# Altium project TP_IHM.PrjPCB
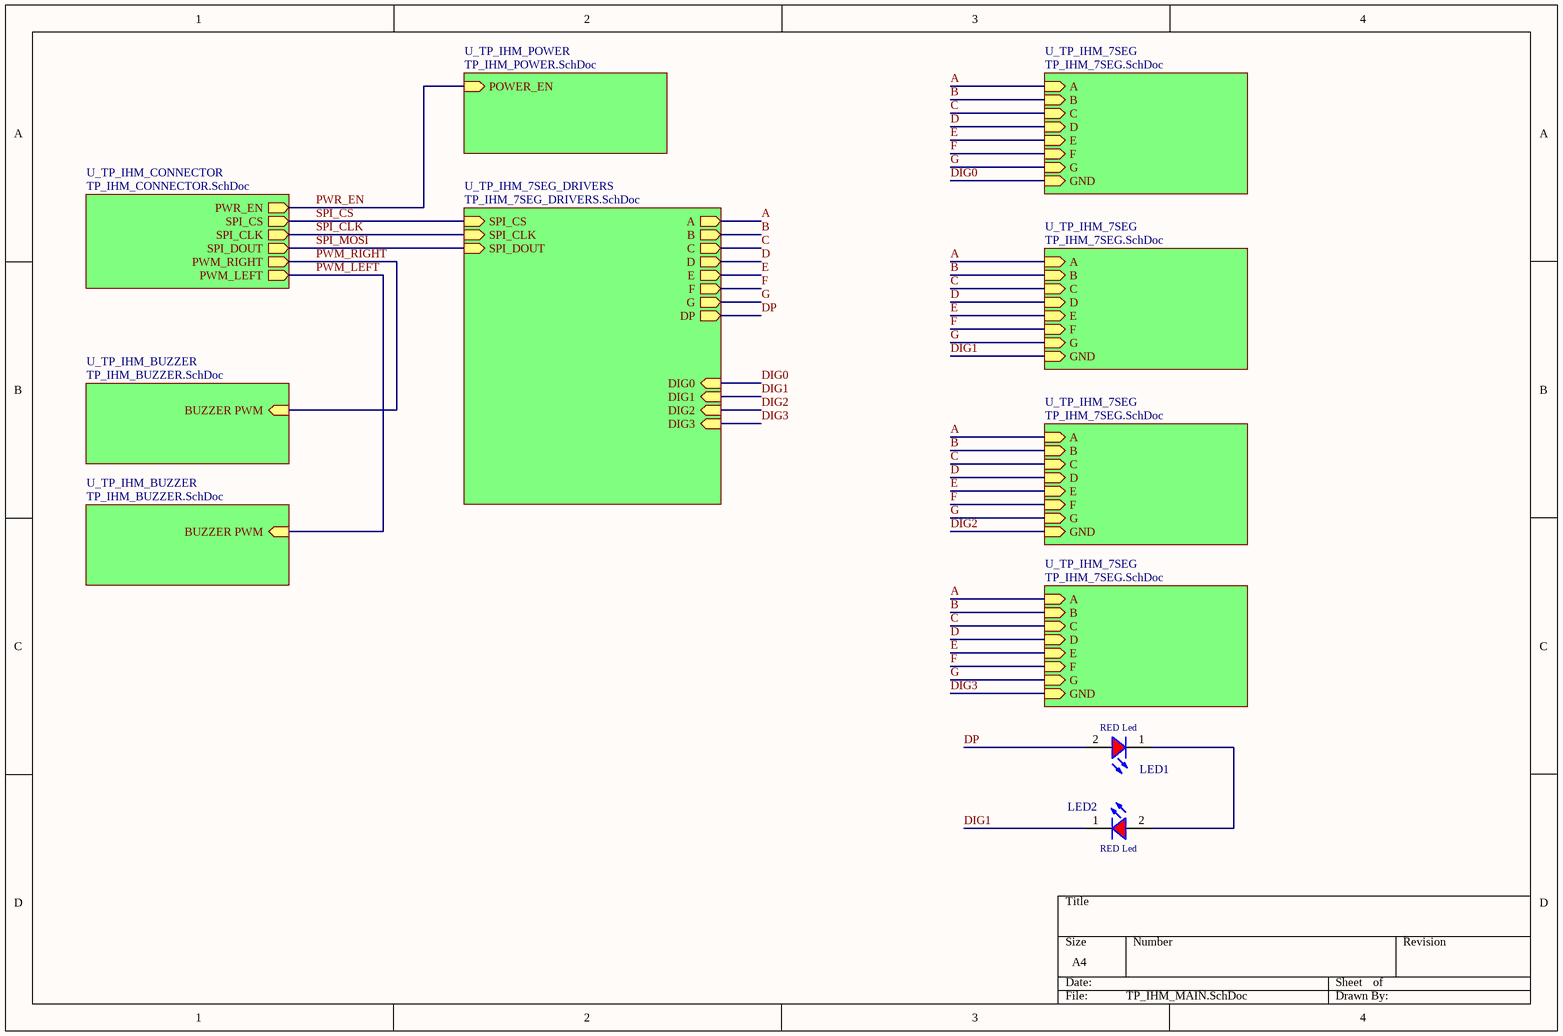
[diagram p0: TP_IHM_MAIN.SchDoc]
6 sheets, 56 parts. Net scope: hierarchical (ports join the sheet entries above them; power ports are global).
Sheets:
  TP_IHM_MAIN.SchDoc
    U_TP_IHM_BUZZER = TP_IHM_BUZZER.SchDoc
    U_TP_IHM_BUZZER = TP_IHM_BUZZER.SchDoc
    U_TP_IHM_POWER = TP_IHM_POWER.SchDoc
    U_TP_IHM_7SEG = TP_IHM_7SEG.SchDoc
    U_TP_IHM_7SEG = TP_IHM_7SEG.SchDoc
    U_TP_IHM_7SEG = TP_IHM_7SEG.SchDoc
    U_TP_IHM_7SEG = TP_IHM_7SEG.SchDoc
    U_TP_IHM_7SEG_DRIVERS = TP_IHM_7SEG_DRIVERS.SchDoc
    U_TP_IHM_CONNECTOR = TP_IHM_CONNECTOR.SchDoc

## Sheet TP_IHM_MAIN.SchDoc
size A4

### Parts
LED1  RED Led  [LED_0603_RED]
LED2  RED Led  [LED_0603_RED]

### Sub-sheets
U_TP_IHM_7SEG = TP_IHM_7SEG.SchDoc: A (in), B (in), C (in), D (in), E (in), F (in), G (in), GND (in)
U_TP_IHM_7SEG = TP_IHM_7SEG.SchDoc: A (in), B (in), C (in), D (in), E (in), F (in), G (in), GND (in)
U_TP_IHM_7SEG = TP_IHM_7SEG.SchDoc: A (in), B (in), C (in), D (in), E (in), F (in), G (in), GND (in)
U_TP_IHM_7SEG = TP_IHM_7SEG.SchDoc: A (in), B (in), C (in), D (in), E (in), F (in), G (in), GND (in)
U_TP_IHM_7SEG_DRIVERS = TP_IHM_7SEG_DRIVERS.SchDoc: DIG3 (in), DIG2 (in), DIG1 (in), DIG0 (in), DP (out), G (out), F (out), E (out), D (out), C (out), B (out), A (out), SPI_CS (in), SPI_CLK (in), SPI_DOUT (in)
U_TP_IHM_BUZZER = TP_IHM_BUZZER.SchDoc: BUZZER PWM (in)
U_TP_IHM_BUZZER = TP_IHM_BUZZER.SchDoc: BUZZER PWM (in)
U_TP_IHM_CONNECTOR = TP_IHM_CONNECTOR.SchDoc: PWM_LEFT (out), PWM_RIGHT (out), PWR_EN (out), SPI_CS (out), SPI_CLK (out), SPI_DOUT (out)
U_TP_IHM_POWER = TP_IHM_POWER.SchDoc: POWER_EN (in)

### Nets
A: sheet U_TP_IHM_7SEG/A, sheet U_TP_IHM_7SEG/A, sheet U_TP_IHM_7SEG/A, sheet U_TP_IHM_7SEG/A, sheet U_TP_IHM_7SEG_DRIVERS/A
B: sheet U_TP_IHM_7SEG/B, sheet U_TP_IHM_7SEG/B, sheet U_TP_IHM_7SEG/B, sheet U_TP_IHM_7SEG/B, sheet U_TP_IHM_7SEG_DRIVERS/B
C: sheet U_TP_IHM_7SEG/C, sheet U_TP_IHM_7SEG/C, sheet U_TP_IHM_7SEG/C, sheet U_TP_IHM_7SEG/C, sheet U_TP_IHM_7SEG_DRIVERS/C
D: sheet U_TP_IHM_7SEG/D, sheet U_TP_IHM_7SEG/D, sheet U_TP_IHM_7SEG/D, sheet U_TP_IHM_7SEG/D, sheet U_TP_IHM_7SEG_DRIVERS/D
DIG0: sheet U_TP_IHM_7SEG/GND, sheet U_TP_IHM_7SEG_DRIVERS/DIG0
DIG1: LED2.1(K) ; sheet U_TP_IHM_7SEG/GND, sheet U_TP_IHM_7SEG_DRIVERS/DIG1
DIG2: sheet U_TP_IHM_7SEG/GND, sheet U_TP_IHM_7SEG_DRIVERS/DIG2
DIG3: sheet U_TP_IHM_7SEG/GND, sheet U_TP_IHM_7SEG_DRIVERS/DIG3
DP: LED1.2(A) ; sheet U_TP_IHM_7SEG_DRIVERS/DP
E: sheet U_TP_IHM_7SEG/E, sheet U_TP_IHM_7SEG/E, sheet U_TP_IHM_7SEG/E, sheet U_TP_IHM_7SEG/E, sheet U_TP_IHM_7SEG_DRIVERS/E
F: sheet U_TP_IHM_7SEG/F, sheet U_TP_IHM_7SEG/F, sheet U_TP_IHM_7SEG/F, sheet U_TP_IHM_7SEG/F, sheet U_TP_IHM_7SEG_DRIVERS/F
G: sheet U_TP_IHM_7SEG/G, sheet U_TP_IHM_7SEG/G, sheet U_TP_IHM_7SEG/G, sheet U_TP_IHM_7SEG/G, sheet U_TP_IHM_7SEG_DRIVERS/G
PWM_LEFT: sheet U_TP_IHM_BUZZER/BUZZER PWM, sheet U_TP_IHM_CONNECTOR/PWM_LEFT
PWM_RIGHT: sheet U_TP_IHM_BUZZER/BUZZER PWM, sheet U_TP_IHM_CONNECTOR/PWM_RIGHT
PWR_EN: sheet U_TP_IHM_POWER/POWER_EN, sheet U_TP_IHM_CONNECTOR/PWR_EN
SPI_CLK: sheet U_TP_IHM_7SEG_DRIVERS/SPI_CLK, sheet U_TP_IHM_CONNECTOR/SPI_CLK
SPI_CS: sheet U_TP_IHM_7SEG_DRIVERS/SPI_CS, sheet U_TP_IHM_CONNECTOR/SPI_CS
SPI_MOSI: sheet U_TP_IHM_7SEG_DRIVERS/SPI_DOUT, sheet U_TP_IHM_CONNECTOR/SPI_DOUT
NetLED1_1: LED1.1(K) LED2.2(A)

### Library data of the parts
LED1 LED2 = LED_RED_SMD_WE_150060RS750x0: LED RED SMD WE 150060RS750x0; ref: 150060RS750x0

## Sheet TP_IHM_BUZZER.SchDoc
size A4
Used 2 times, as channels U_TP_IHM_BUZZER, U_TP_IHM_BUZZER. Parts and nets are listed once, with the designators drawn on the sheet.
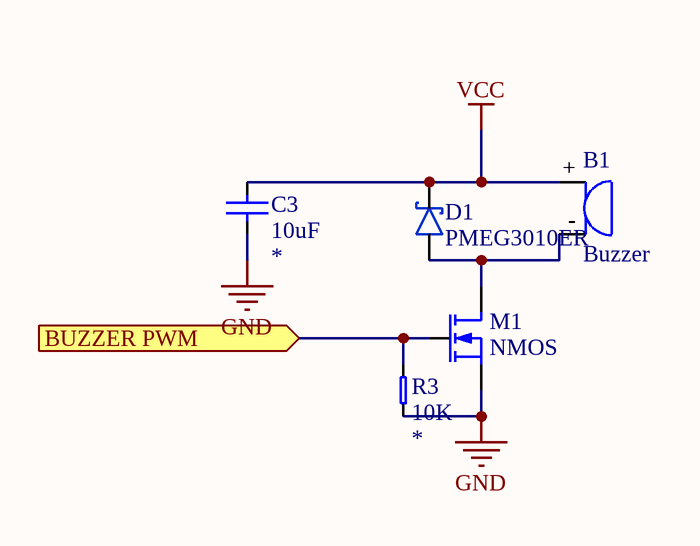
[diagram p1: TP_IHM_BUZZER.SchDoc]

### Parts
B1  Buzzer  [SD160709]
C3  value 10uF  [0603_CAP_LD]  (hidden comment: CerCap)
D1  PMEG3010ER  [SOD123W]
M1  NMOS  [MOSFET-SOT23]
R3  value 10K  [0603_RES_LD]  (hidden comment: Resistor)

### Ports
BUZZER PWM (in)

### Nets
GND: C3.1 M1.S R3.1
VCC: B1.+ C3.2 D1.K
BUZZER PWM: M1.G R3.2 ; port BUZZER PWM
NetB1_-: B1.- D1.A M1.D

### Channels
U_TP_IHM_BUZZER: designators B1=B1.1 C3=C1.3 D1=D1.1 M1=M1.1 R3=R1.3; ports BUZZER PWM=PWM_RIGHT
U_TP_IHM_BUZZER: designators B1=B2.1 C3=C2.3 D1=D2.1 M1=M2.1 R3=R2.3; ports BUZZER PWM=PWM_LEFT

### Library data of the parts
B1 = SD160709: TDK SD160709 Buzzer; Reference: SD160709
C3 = CerCap: Ceramic Capacitor; Type: *; Voltage/Power: *; Package: *
D1 = Schottky_PMEG3010ER: Nexperia 1A low Vf Mega Schottky barrier rectifier; Reference: PMEG3010ER
M1 = N-MOSFET: N MOSFET
R3 = Resistor: Precision: *; Package: *

## Sheet TP_IHM_POWER.SchDoc
size A4
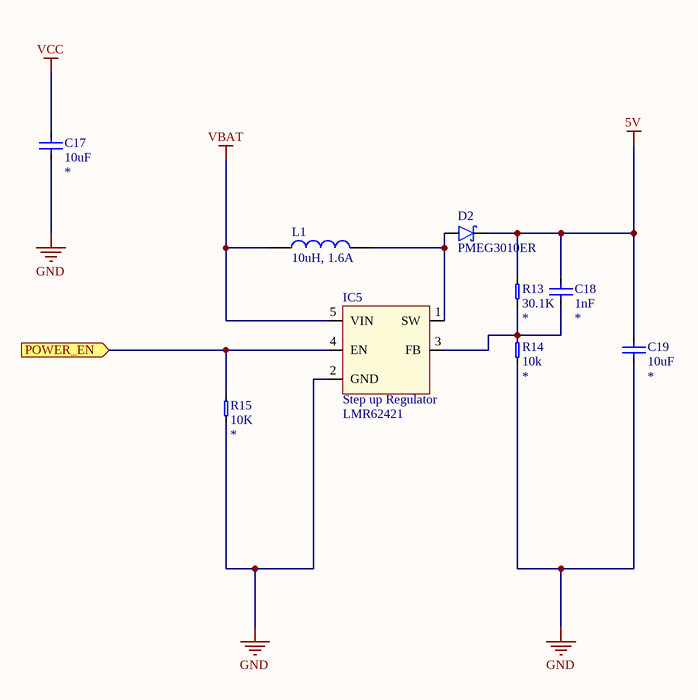
[diagram p2: TP_IHM_POWER.SchDoc]

### Parts
C17  value 10uF  [0603_CAP_LD]  (hidden comment: CerCap)
C18  value 1nF  [0603_CAP_LD]  (hidden comment: CerCap)
C19  value 10uF  [0603_CAP_LD]  (hidden comment: CerCap)
D2  PMEG3010ER  [SOD123W]
IC5  Step up Regulator  [LMR62421]
L1  10uH, 1.6A  [INDUCTOR_WE-LQS_5020]
R13  value 30.1K  [0603_RES_LD]  (hidden comment: Resistor)
R14  value 10k  [0603_RES_LD]  (hidden comment: Resistor)
R15  value 10K  [0603_RES_LD]  (hidden comment: Resistor)

### Ports
POWER_EN (in)

### Nets
5V: C18.2 C19.2 D2.K R13.2
GND: C17.1 C19.1 IC5.2(GND) R14.1 R15.1
VBAT: IC5.5(VIN) L1.1
VCC: C17.2
PWR_EN: IC5.4(EN) R15.2 ; port POWER_EN
NetC18_1: C18.1 IC5.3(FB) R13.1 R14.2
NetD2_A: D2.A IC5.1(SW) L1.2

### Library data of the parts
C17-C19 = CerCap: Ceramic Capacitor; Type: *; Voltage/Power: *; Package: *
D2 = Schottky_PMEG3010ER: as D1 on sheet TP_IHM_BUZZER; Reference: PMEG3010ER
IC5 = LMR62421XMF: LMR62421 simple switcher 24 Vout stepup voltage SOT-23; Reference: LMR62421
L1 = INDUCTOR_74404052100: WE-LQS SMD Power Inductor, size 5020, 10uH, 1.6A; DC Resistance: 109mOhm; Inductance Tolerance: +/-20%; Saturation Current: 1.95A; Self Resonant Frequency: 37MHz; ComponentLink1Description: Manufacturer; ComponentLink1URL: http://www.we-online.de; ComponentLink2Description: Datasheet; ComponentLink2URL: https://katalog.we-online.com/pbs/datasheet/74404052100.pdf; Part Number: 74404052100; Published Date: May 2019; Publisher: Wurth Elektronik; Rated Current: 1.6A; Inductance: 10uH; Operating Temperature: -40 to +125degC; Mounting Technology: SMT; Packaging: Tape and Reel; DC Resistance Tolerance: +/-20%; Size: 5020; Reference: 74404052100
R13-R15 = Resistor: Precision: *; Package: *

## Sheet TP_IHM_7SEG.SchDoc
size A4
Used 4 times, as channels U_TP_IHM_7SEG, U_TP_IHM_7SEG, U_TP_IHM_7SEG, U_TP_IHM_7SEG. Parts and nets are listed once, with the designators drawn on the sheet.
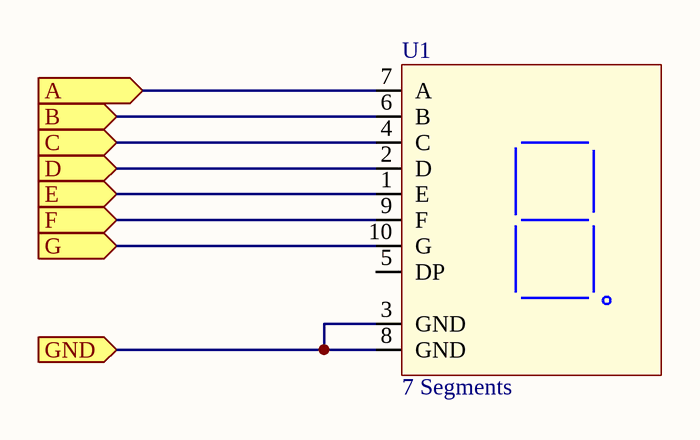
[diagram p3: TP_IHM_7SEG.SchDoc]

### Parts
U1  7 Segments  [SA10-21GWA]

### Ports
A (in), B (in), C (in), D (in), E (in), F (in), G (in), GND (in)

### Nets
A: U1.7(A) ; port A
B: U1.6(B) ; port B
C: U1.4(C) ; port C
D: U1.2(D) ; port D
E: U1.1(E) ; port E
F: U1.9(F) ; port F
G: U1.10(G) ; port G
GND: U1.3(GND) U1.8(GND) ; port GND

Not connected (* = marked no-connect by the designer): U1 5(DP)

### Channels
U_TP_IHM_7SEG: designators end in .1; ports A=A B=B C=C D=D E=E F=F G=G GND=DIG0
U_TP_IHM_7SEG: designators U1=U2.1; ports A=A B=B C=C D=D E=E F=F G=G GND=DIG1
U_TP_IHM_7SEG: designators U1=U3.1; ports A=A B=B C=C D=D E=E F=F G=G GND=DIG2
U_TP_IHM_7SEG: designators U1=U4.1; ports A=A B=B C=C D=D E=E F=F G=G GND=DIG3

### Library data of the parts
U1 = SC10-21SRWA: KingBright Led 7 Segments; Reference: SC10-21SRWA

## Sheet TP_IHM_7SEG_DRIVERS.SchDoc
size A4
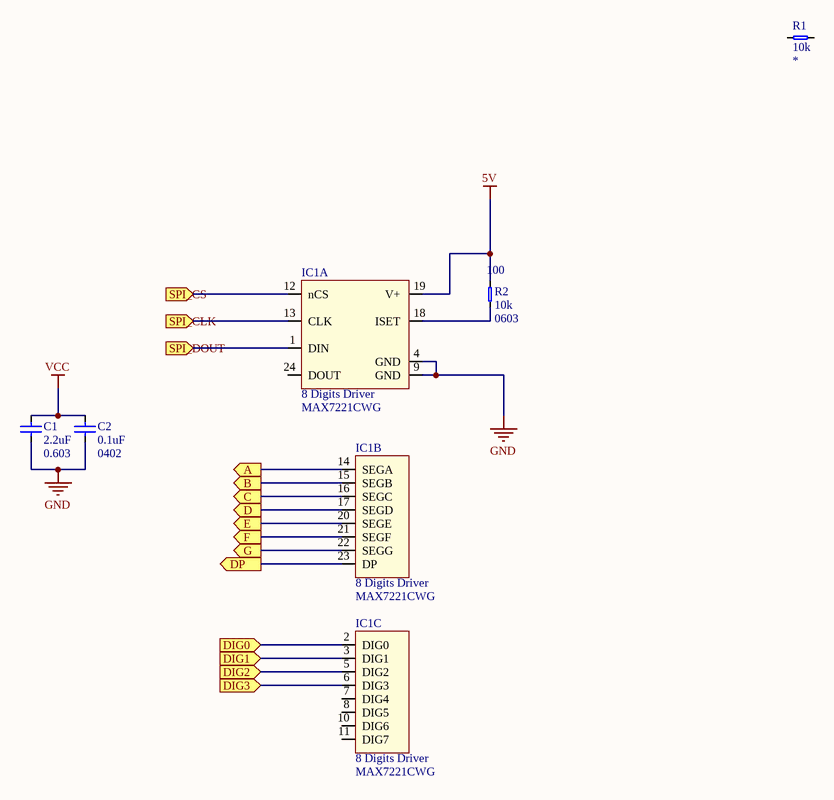
[diagram p4: TP_IHM_7SEG_DRIVERS.SchDoc]

### Parts
C1  value 2.2uF  Package: 0.603  [0603_CAP_LD]  (hidden comment: CerCap)
C2  value 0.1uF  Package: 0402  [0603_CAP_LD]  (hidden comment: CerCap)
IC1  8 Digits Driver  [MAX7221CWG]  (parts A,B,C of 3)
R1  value 10k  [0603_RES_LD]  (hidden comment: Resistor)
R2  value 10k  Precision: 100  Package: 0603  [0603_RES_LD]  (hidden comment: Resistor)

### Ports
A (out), B (out), C (out), D (out), DIG0 (in), DIG1 (in), DIG2 (in), DIG3 (in), DP (out), E (out), F (out), G (out), SPI_CLK (in), SPI_CS (in), SPI_DOUT (in)

### Nets
5V: IC1.19(V+) R2.2
GND: C1.1 C2.1 IC1.4(GND) IC1.9(GND)
VCC: C1.2 C2.2
A: IC1.14(SEGA) ; port A
B: IC1.15(SEGB) ; port B
C: IC1.16(SEGC) ; port C
D: IC1.17(SEGD) ; port D
DIG0: IC1.2(DIG0) ; port DIG0
DIG1: IC1.3(DIG1) ; port DIG1
DIG2: IC1.5(DIG2) ; port DIG2
DIG3: IC1.6(DIG3) ; port DIG3
DP: IC1.23(DP) ; port DP
E: IC1.20(SEGE) ; port E
F: IC1.21(SEGF) ; port F
G: IC1.22(SEGG) ; port G
SPI_CLK: IC1.13(CLK) ; port SPI_CLK
SPI_CS: IC1.12(nCS) ; port SPI_CS
SPI_MOSI: IC1.1(DIN) ; port SPI_DOUT
NetIC1_18: IC1.18(ISET) R2.1

Not connected (* = marked no-connect by the designer): IC1 7(DIG4) 8(DIG5) 10(DIG6) 11(DIG7) 24(DOUT); R1 1 2

### Library data of the parts
C1 C2 = CerCap: Ceramic Capacitor; Type: *; Voltage/Power: *
IC1 = MAX7221: MAX7221 8 Digit 7 Segments Display; Reference: MAX7221CWG
R1 R2 = Resistor
  R1: Precision: *; Package: *

## Sheet TP_IHM_CONNECTOR.SchDoc
size A4
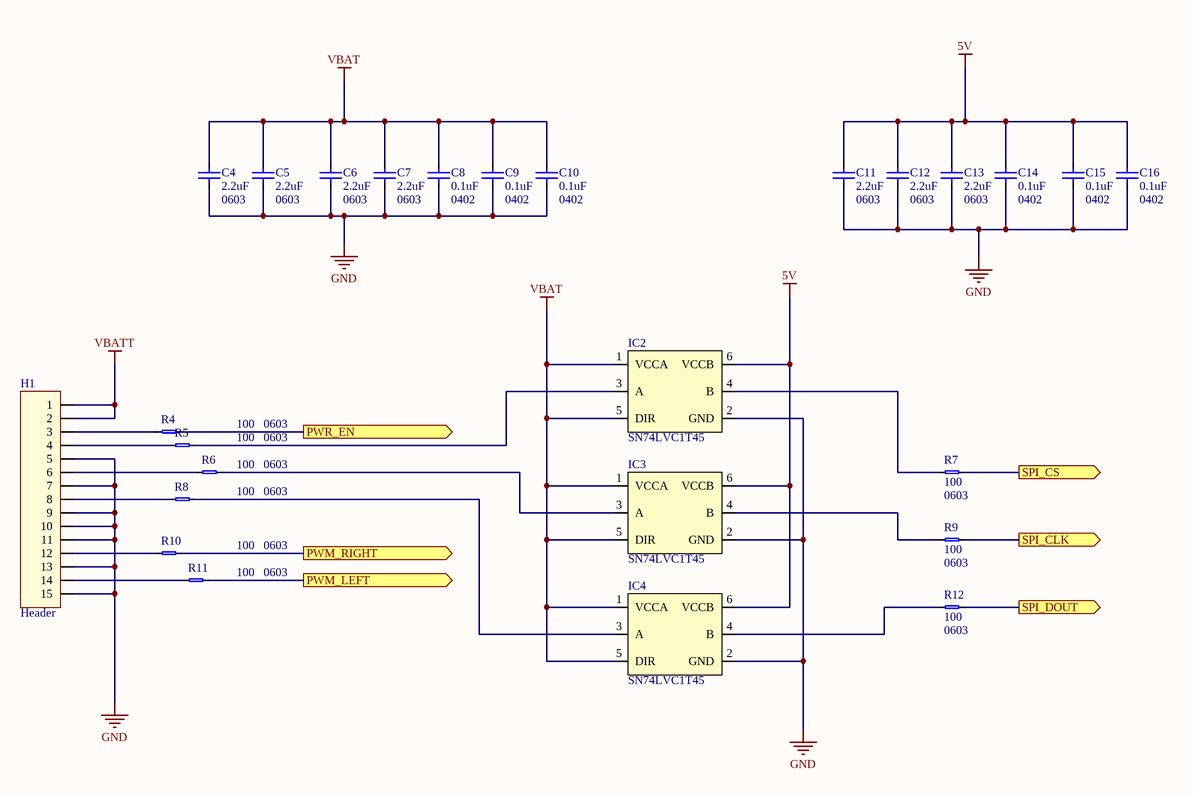
[diagram p5: TP_IHM_CONNECTOR.SchDoc]

### Parts
C4  value 2.2uF  Package: 0603  [0603_CAP_LD]  (hidden comment: CerCap)
C5  value 2.2uF  Package: 0603  [0603_CAP_LD]  (hidden comment: CerCap)
C6  value 2.2uF  Package: 0603  [0603_CAP_LD]  (hidden comment: CerCap)
C7  value 2.2uF  Package: 0603  [0603_CAP_LD]  (hidden comment: CerCap)
C8  value 0.1uF  Package: 0402  [0603_CAP_LD]  (hidden comment: CerCap)
C9  value 0.1uF  Package: 0402  [0603_CAP_LD]  (hidden comment: CerCap)
C10  value 0.1uF  Package: 0402  [0603_CAP_LD]  (hidden comment: CerCap)
C11  value 2.2uF  Package: 0603  [0603_CAP_LD]  (hidden comment: CerCap)
C12  value 2.2uF  Package: 0603  [0603_CAP_LD]  (hidden comment: CerCap)
C13  value 2.2uF  Package: 0603  [0603_CAP_LD]  (hidden comment: CerCap)
C14  value 0.1uF  Package: 0402  [0603_CAP_LD]  (hidden comment: CerCap)
C15  value 0.1uF  Package: 0402  [0603_CAP_LD]  (hidden comment: CerCap)
C16  value 0.1uF  Package: 0402  [0603_CAP_LD]  (hidden comment: CerCap)
H1  Header  [653115131822]
IC2  SN74LVC1T45  [MO-203AB_LD]
IC3  SN74LVC1T45  [MO-203AB_LD]
IC4  SN74LVC1T45  [MO-203AB_LD]
R4  Precision: 100  Package: 0603  [0603_RES_LD]  (hidden comment: Resistor)
R5  Precision: 100  Package: 0603  [0603_RES_LD]  (hidden comment: Resistor)
R6  Precision: 100  Package: 0603  [0603_RES_LD]  (hidden comment: Resistor)
R7  value 100  Package: 0603  [0603_RES_LD]  (hidden comment: Resistor)
R8  Precision: 100  Package: 0603  [0603_RES_LD]  (hidden comment: Resistor)
R9  value 100  Package: 0603  [0603_RES_LD]  (hidden comment: Resistor)
R10  Precision: 100  Package: 0603  [0603_RES_LD]  (hidden comment: Resistor)
R11  Precision: 100  Package: 0603  [0603_RES_LD]  (hidden comment: Resistor)
R12  value 100  Package: 0603  [0603_RES_LD]  (hidden comment: Resistor)

### Ports
PWM_LEFT (out), PWM_RIGHT (out), PWR_EN (out), SPI_CLK (out), SPI_CS (out), SPI_DOUT (out)

### Nets
5V: C11.2 C12.2 C13.2 C14.2 C15.2 C16.2 IC2.6(VCCB) IC3.6(VCCB) IC4.6(VCCB)
GND: C4.1 C5.1 C6.1 C7.1 C8.1 C9.1 C10.1 C11.1 C12.1 C13.1 C14.1 C15.1 C16.1 H1.5 H1.7 H1.9 H1.10 H1.11 H1.13 H1.15 IC2.2(GND) IC3.2(GND) IC4.2(GND)
VBAT: C4.2 C5.2 C6.2 C7.2 C8.2 C9.2 C10.2 IC2.1(VCCA) IC2.5(DIR) IC3.1(VCCA) IC3.5(DIR) IC4.1(VCCA) IC4.5(DIR)
VBATT: H1.1 H1.2
PWM_LEFT: R11.2 ; port PWM_LEFT
PWM_RIGHT: R10.2 ; port PWM_RIGHT
PWR_EN: R4.2 ; port PWR_EN
SPI_CLK: R9.2 ; port SPI_CLK
SPI_CS: R7.2 ; port SPI_CS
SPI_MOSI: R12.2 ; port SPI_DOUT
NetH1_3: H1.3 R4.1
NetH1_4: H1.4 R5.1
NetH1_6: H1.6 R6.1
NetH1_8: H1.8 R8.1
NetH1_12: H1.12 R10.1
NetH1_14: H1.14 R11.1
NetIC2_3: IC2.3(A) R5.2
NetIC2_4: IC2.4(B) R7.1
NetIC3_3: IC3.3(A) R6.2
NetIC3_4: IC3.4(B) R9.1
NetIC4_3: IC4.3(A) R8.2
NetIC4_4: IC4.4(B) R12.1

### Library data of the parts
C4-C16 = CerCap: Ceramic Capacitor; Type: *; Voltage/Power: *
H1 = HEADER_15x1: Header 15x1
IC2-IC4 = SN74LVC1T45: Single Bit Dual Supply Buffer
R4-R6 R8 R10 R11 = Resistor: Value: 10k
R7 R9 R12 = Resistor: Precision: *

## Nets that join several sheets
5V: TP_IHM_POWER (C18.2 C19.2 D2.K R13.2), TP_IHM_7SEG_DRIVERS (IC1.19 R2.2), TP_IHM_CONNECTOR (9 pins)
GND: U_TP_IHM_BUZZER (C1.3.1 M1.1.S R1.3.1), U_TP_IHM_BUZZER (C2.3.1 M2.1.S R2.3.1), TP_IHM_POWER (5 pins), TP_IHM_7SEG_DRIVERS (C1.1 C2.1 IC1.4 IC1.9), TP_IHM_CONNECTOR (23 pins)
VBAT: TP_IHM_POWER (IC5.5 L1.1), TP_IHM_CONNECTOR (13 pins)
VCC: U_TP_IHM_BUZZER (B1.1.+ C1.3.2 D1.1.K), U_TP_IHM_BUZZER (B2.1.+ C2.3.2 D2.1.K), TP_IHM_POWER (C17.2), TP_IHM_7SEG_DRIVERS (C1.2 C2.2)
A: U_TP_IHM_7SEG (U1.1.7), U_TP_IHM_7SEG (U2.1.7), U_TP_IHM_7SEG (U3.1.7), U_TP_IHM_7SEG (U4.1.7), TP_IHM_7SEG_DRIVERS (IC1.14)
B: U_TP_IHM_7SEG (U1.1.6), U_TP_IHM_7SEG (U2.1.6), U_TP_IHM_7SEG (U3.1.6), U_TP_IHM_7SEG (U4.1.6), TP_IHM_7SEG_DRIVERS (IC1.15)
C: U_TP_IHM_7SEG (U1.1.4), U_TP_IHM_7SEG (U2.1.4), U_TP_IHM_7SEG (U3.1.4), U_TP_IHM_7SEG (U4.1.4), TP_IHM_7SEG_DRIVERS (IC1.16)
D: U_TP_IHM_7SEG (U1.1.2), U_TP_IHM_7SEG (U2.1.2), U_TP_IHM_7SEG (U3.1.2), U_TP_IHM_7SEG (U4.1.2), TP_IHM_7SEG_DRIVERS (IC1.17)
DIG0: U_TP_IHM_7SEG (U1.1.3 U1.1.8), TP_IHM_7SEG_DRIVERS (IC1.2)
DIG1: TP_IHM_MAIN (LED2.1), U_TP_IHM_7SEG (U2.1.3 U2.1.8), TP_IHM_7SEG_DRIVERS (IC1.3)
DIG2: U_TP_IHM_7SEG (U3.1.3 U3.1.8), TP_IHM_7SEG_DRIVERS (IC1.5)
DIG3: U_TP_IHM_7SEG (U4.1.3 U4.1.8), TP_IHM_7SEG_DRIVERS (IC1.6)
DP: TP_IHM_MAIN (LED1.2), TP_IHM_7SEG_DRIVERS (IC1.23)
E: U_TP_IHM_7SEG (U1.1.1), U_TP_IHM_7SEG (U2.1.1), U_TP_IHM_7SEG (U3.1.1), U_TP_IHM_7SEG (U4.1.1), TP_IHM_7SEG_DRIVERS (IC1.20)
F: U_TP_IHM_7SEG (U1.1.9), U_TP_IHM_7SEG (U2.1.9), U_TP_IHM_7SEG (U3.1.9), U_TP_IHM_7SEG (U4.1.9), TP_IHM_7SEG_DRIVERS (IC1.21)
G: U_TP_IHM_7SEG (U1.1.10), U_TP_IHM_7SEG (U2.1.10), U_TP_IHM_7SEG (U3.1.10), U_TP_IHM_7SEG (U4.1.10), TP_IHM_7SEG_DRIVERS (IC1.22)
PWM_LEFT: U_TP_IHM_BUZZER (M2.1.G R2.3.2), TP_IHM_CONNECTOR (R11.2)
PWM_RIGHT: U_TP_IHM_BUZZER (M1.1.G R1.3.2), TP_IHM_CONNECTOR (R10.2)
PWR_EN: TP_IHM_POWER (IC5.4 R15.2), TP_IHM_CONNECTOR (R4.2)
SPI_CLK: TP_IHM_7SEG_DRIVERS (IC1.13), TP_IHM_CONNECTOR (R9.2)
SPI_CS: TP_IHM_7SEG_DRIVERS (IC1.12), TP_IHM_CONNECTOR (R7.2)
SPI_MOSI: TP_IHM_7SEG_DRIVERS (IC1.1), TP_IHM_CONNECTOR (R12.2)